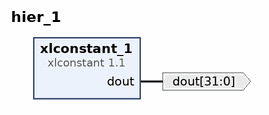
[diagram p0: block diagram of the top level]
# Vivado block design hier_1, xck26-sfvc784-2LV-c, Vivado 2023.2
create_bd_design hier_1

create_bd_port -dir O -from 31 -to 0 dout

create_bd_cell -type ip -vlnv xilinx.com:ip:xlconstant:1.1 xlconstant_1
set_property -dict {CONFIG.CONST_VAL 1701 CONFIG.CONST_WIDTH 32} [get_bd_cells xlconstant_1]

# ---- connections ----

connect_bd_net [get_bd_pins xlconstant_1/dout] [get_bd_ports dout]

validate_bd_design
save_bd_design
